# Altium schematic sheet PCB_schematic.SchDoc
size A; SheetNumber: 1; SheetTotal: 1; SPICEModelCacheMTJXNGYC: <root> / <DocumentId>MTJXNGYC</DocumentId> / </root>
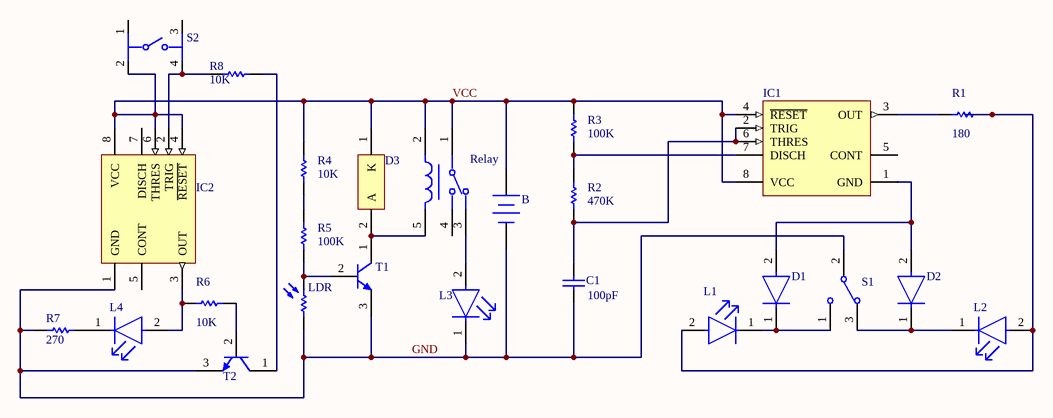
[diagram p0: PCB_schematic.SchDoc]

## Parts
B  Battery  [BAT-2]  (value not drawn)
C1  value 100pF  [RAD-0.3]  (hidden comment: Cap)
D1  1N4007-E3/54  [FP-1N4007-MFG]  (value not drawn)
D2  1N4007-E3/54  [FP-1N4007-MFG]  (value not drawn)
D3  1N4001  [ONSC-AXIAL_LEAD-2-59-10_P]  (value not drawn)
IC1  NE555P  [P0008A]  (value not drawn)
IC2  NE555P  [P0008A]  (value not drawn)
L1  HLMP-1719  [FP-HLMP-1719-MFG]  (value not drawn)
L2  HLMP-1719  [FP-HLMP-1719-MFG]  (value not drawn)
L3  HLMP-1719  [FP-HLMP-1719-MFG]  (value not drawn)
L4  HLMP-1719  [FP-HLMP-1719-MFG]  (value not drawn)
LDR  VT90N1  [EXCE-VT90N1]  (value not drawn)
R1  value 180  [AXIAL-0.3]  (hidden comment: Res1)
R2  value 470K  [AXIAL-0.3]  (hidden comment: Res1)
R3  value 100K  [AXIAL-0.3]  (hidden comment: Res1)
R4  value 10K  [AXIAL-0.3]  (hidden comment: Res1)
R5  value 100K  [AXIAL-0.3]  (hidden comment: Res1)
R6  value 10K  [AXIAL-0.3]  (hidden comment: Res1)
R7  value 270  [AXIAL-0.3]  (hidden comment: Res1)
R8  value 10K  [AXIAL-0.3]  (hidden comment: Res1)
Relay  JS1F-12V-F  [FP-JS1F-12V-F-MFG]  (value not drawn)
S1  SW-SPDT  [TL36WW15050]  (value not drawn)
S2  3-1825910-1  [FP-3-1825910-1-MFG]  (value not drawn)
T1  BC547B  [ONSC-TO-92-3-29-11]  (value not drawn)
T2  BC547B  [ONSC-TO-92-3-29-11]  (value not drawn)

## Nets
GND: B.2(-) C1.1 IC2.1(GND) L3.1(C) LDR.1 R7.1 S1.2 T1.3(E) T2.3(E)
VCC: B.1(+) D3.1(K) IC1.4(~{RESET}) IC1.8(VCC) IC2.4(~{RESET}) IC2.6(THRES) IC2.8(VCC) R3.2 R4.2 Relay.1(COM) Relay.2 S2.2
NetC1_2: C1.2 IC1.2(TRIG) IC1.6(THRES) R2.1
NetD1_1: D1.1(C) L1.1(C) S1.1
NetD1_2: D1.2(A) D2.2(A) IC1.1(GND)
NetD2_1: D2.1(C) L2.1(C) S1.3
NetD3_2: D3.2(A) Relay.5 T1.1(C)
NetIC1_3: IC1.3(OUT) R1.2
NetIC1_7: IC1.7(DISCH) R2.2 R3.1
NetIC2_2: IC2.2(TRIG) R8.1 S2.4
NetIC2_3: IC2.3(OUT) L4.2(A) R6.1
NetL1_2: L1.2(A) L2.2(A) R1.1
NetL3_2: L3.2(A) Relay.3(NO)
NetL4_1: L4.1(C) R7.2
NetLDR_2: LDR.2 R5.1 T1.2(B)
NetR4_1: R4.1 R5.2
NetR6_2: R6.2 T2.2(B)
NetR8_2: R8.2 T2.1(C)

Not connected (* = marked no-connect by the designer): IC1 5(CONT); IC2 5(CONT) 7(DISCH); Relay 4(NC); S2 1 3

## Library data of the parts
B = Battery: Multicell Battery; Published: 24-Mar-1999; LatestRevisionDate: 17-Jul-2002; LatestRevisionNote: Re-released for DXP Platform.; PackageReference: BAT-2; Publisher: Altium Limited; PackageDescription: Battery; 2 Leads
C1 = Cap: Capacitor; Published: 8-Jun-2000; LatestRevisionDate: 17-Jul-2002; LatestRevisionNote: Re-released for DXP Platform.; PackageReference: RAD-0.3; Publisher: Altium Limited; PackageDescription: Radial Cap, Thru-Hole; 2 Leads; 0.3 in Pin Spacing
D1 D2 = CMP-02540-000046-1: DIODE GEN PURP 1KV 1A DO204AL; Manufacturer: Vishay; Value: 15pF; Max Junction Temp: +150°C; Max Surge Forward Current: 30A; Max Repetitive Reverse Voltage: 1000V; Peak Reverse Current: 30uA; Octopart: https://octopart.com/1n4007-e3%2F54-vishay-39548207; Digikey Description: DIODE GEN PURP 1KV 1A DO204AL; Category: Diode; Mouser Description: Rectifiers Vr/1000V Io/1A; Automotive: No; Package: 1N4007; Device Class L3: Rectifier Diodes; Temperature Range High: +150°C; Capacitance: 15pF; Ipc Land Pattern Name: DIOPA1088W105L520D270; Lead Free: Yes; ComponentLink2Description: Datasheet; Forward Current: 1A; Device Class L1: Discrete Semiconductors; ComponentLink2URL: http://www.vishay.com/docs/88503/1n4001.pdf; Temperature Range Low: -50°C; Height: 2.7mm; RoHS: TRUE; Temperature: -50°C to +150°C; Device Class L2: Diodes; Manufacturer Part Number: 1N4007-E3/54
D3 = CMP-0902-00117-1: Standard Recovery Rectifier, 2-Pin Axial_Lead, Pb-Free, Bulk Bag; Manufacturer: On Semiconductor; VRRM Max (V): 50; IFSM Max (A): 30; IO(rec) Max (A): 1; ComponentLink3URL: http://www.onsemi.cn/pub_link/Collateral/59-10.PDF; ComponentLink3Description: Package Specification; PartNumber: 1N4001; PackageVersion: Rev. U, 02/2005; Packing: Bulk Bag; ComponentLink2Description: Datasheet; RoHS: TRUE; DatasheetVersion: Rev. 13; PackageReference: AXIAL_LEAD-2-59-10; ComponentLink1URL: http://www.onsemi.com/; Mounting Technology: Through Hole; PackageDescription: 2-Pin, Axial Lead, Diameter 2.35 mm; ComponentLink2URL: http://www.onsemi.com/pub_link/Collateral/1N4001-D.PDF; Type: Standard Recovery; ComponentLink1Description: Manufacturer URL
IC1 IC2 = CMP-2000-04954-1: Precision Timer, 4.5 to 16 V, 0 to 70 degC, 8-Pin DIP, Pb-Free, Tube; Manufacturer: TexasInstruments; Maximum High Level Output Current: -200mA; Number of Internal Timers: 1; Operating Supply Voltage: 5; Maximum Low Level Output Current: 200mA; Rad Hard: No; Packaging: Rail/Tube; Manufacturer URL: http://www.ti.com/; Package Reference: P8; Package Description: 8-Pin Double In-line Package, Body 9.59 x 6.35 mm, Pitch 2.54 mm; Package URL: http://www.ti.com/lit/ml/mpdi001b/mpdi001b.pdf; Type: Standard; Datasheet URL: http://www.ti.com/general/docs/lit/getliterature.tsp?genericPartNumber=NE555&fileType=pdf; Category: Timer; Package: 8PDIP; Datasheet Version: Rev. I, 09/2014
L1-L4 = CMP-2000-06410-2: LED YELLOW DIFFUSED T-1 T/H; Manufacturer: Broadcom; Wavelength: 585nm; Led Orientation: Straight; Luminous Intensity: 2.1mcd; Forward Voltage: 1.8V; Viewing Angle: 50°; Description: LED Uni-Color Yellow 2-Pin T-1; Reverse Voltage: 5V; Power Dissipation: 17.5mW; Forward Current: 2mA; Lead Free: Yes; Automotive: No; Device Class L1: Optoelectronics; Mouser Description: Standard LEDs - Through Hole Yellow Diffused 585nm 2.1mcd; Digikey Description: LED YELLOW DIFFUSED T-1 T/H; Temperature: -40°C to +100°C; Temperature Range High: +100°C; Package: 0; Category: Diode; Colour: Yellow; Device Class L2: LEDs; ComponentLink2Description: Datasheet; ComponentLink2URL: https://docs.broadcom.com/docs/AV02-1557EN; Temperature Range Low: -40°C; Device Class L3: unset; Octopart: https://octopart.com/hlmp-1719-broadcom-71130405; RoHS: TRUE; Manufacturer Part Number: HLMP-1719
LDR = CMP-2000-07406-1: Photoconductive Resistor, 200 kOhm, 100 V, 80 mW, -40 to 75 degC, 2-Pin THD, RoHS; Manufacturer: Excelitas Technology; SVHC: Cadmiumchloride(15-Jun-2015); Power Rating: 80mW; Resistance @ Lux: 12kohm; Voltage Rating: 100V; Product Range: -; Datasheet Version: 09/2006; Resistor Case Style: -; Operating Temperature Max: 75°C; Package Reference: VT90N1; Datasheet URL: http://datasheet.octopart.com/VT90N1-Excelitas-datasheet-10388451.pdf; Mounting Technology: ThroughHole; Operating Temperature Min: -40°C; Dark Resistance: 200kohm; Package Description: 2-Pin Through Hole Device, Body Width 4.17 mm (Max), Height 2.29 mm; Manufacturer URL: http://www.excelitas.com/Pages/Index.aspx; Packaging: Each
R1-R8 = Res1: Resistor; Published: 8-Jun-2000; LatestRevisionDate: 17-Jul-2002; LatestRevisionNote: Re-released for DXP Platform.; PackageReference: AXIAL-0.3; Publisher: Altium Limited; PackageDescription: Axial Device, Thru-Hole; 2 Leads; 0.3 in Pin Spacing
Relay = CMP-05607-000089-1: RELAY GEN PURPOSE SPDT 10A 12V; Voltage Rating (AC): 250V; Coil Type: Non-Latching; Coil Current: 30mA; Operate Time: 10ms; Power Consumption: 360mW; Relay Type: General Purpose; Coil Resistance: 400R; Max Voltage Rating (DC): 100V; Min Operating Temperature: -40°C; Contact Material: Silver; Termination: PC Pin; Number of Pins: 5; Depth: 16mm; Weight: 12g; Release Time: 10ms; Max Current Rating: 10A; Series: JS; RoHS Compliant: Yes; Max Voltage Rating (AC): 250V; Length: 22mm; Packaging: Bulk; Radiation Hardening: No; Throw Configuration: SPDT; Coil Voltage (DC): 12V; Coil Power: 360mW; Max Operating Temperature: 70°C; Mount: Through Hole; Package Quantity: 100; Contact Current Rating: 10A
S1 = SW-SPDT: SPDT Subminiature Toggle Switch, Right Angle Mounting, Vertical Actuation; Published: 24-Mar-1999; LatestRevisionDate: 17-Dec-2003; LatestRevisionNote: Schematic revised, PCB Footprint replaced.; DatasheetVersion: 05-Dec-2000; PackageReference: TL36WW15050; Publisher: Altium Limited; PackageDescription: Switch; 4 Leads; ComponentLink1Description: Manufacturer Link; ComponentLink1URL: http://www.apem.com
S2 = CMP-03407-000001-1: SWITCH TACTILE SPST-NO 0.05A 24V; Manufacturer: TE Connectivity; Operating Force: 160gf; Contact Current Rating: 50mA; Contact Resistance: 100mΩ; Electromechanical Life: 100000Cycles; Device Class L1: Electromechanical; ComponentLink2URL: https://www.te.com/commerce/DocumentDelivery/DDEController?Action=srchrtrv&DocNm=1825910&DocType=Customer+Drawing&DocLang=English; Category: Switch; Device Class L2: Switches; Temperature: -35°C to +85°C; RoHS: TRUE; Mount: Through Hole; Manufacturer Part Number: 3-1825910-1; Automotive: No; Lead Free: Yes; Device Class L3: Tactile Switches; ComponentLink2Description: Datasheet; Temperature Range High: +85°C; Height: 17.3mm; Package: 0; Temperature Range Low: -35°C; Throw Configuration: SPST-NO; Digikey Description: SWITCH TACTILE SPST-NO 0.05A 24V; Octopart: https://octopart.com/3-1825910-1-te+connectivity-46506874
T1 T2 = CMP-1048-01467-1: Amplifier Transistor, NPN Silicon, 3-Pin TO-92, Bulk Box; Manufacturer: On Semiconductor; IC Continuous (A): 0.1; fT Min (MHz): 150; DatasheetVersion: Rev. 7; ComponentLink1URL: http://www.onsemi.com/; Polarity: NPN; RoHS: FALSE; ComponentLink1Description: Manufacturer URL; Packing: Bulk Box; PackageDescription: 3-Pin Transistor Outline, Body 4.825 x 3.685 mm, Pitch 1.27 mm; ComponentLink3URL: http://www.onsemi.cn/pub_link/Collateral/2N6426-D.PDF; ComponentLink2Description: Datasheet; PackageVersion: Rev. AM; PackageReference: TO-92-3-29-11_AM_SL; ComponentLink3Description: Package Specification; Mounting Technology: Through Hole; PartNumber: BC547B; ComponentLink2URL: http://www.onsemi.com/pub_link/Collateral/BC546-D.PDF